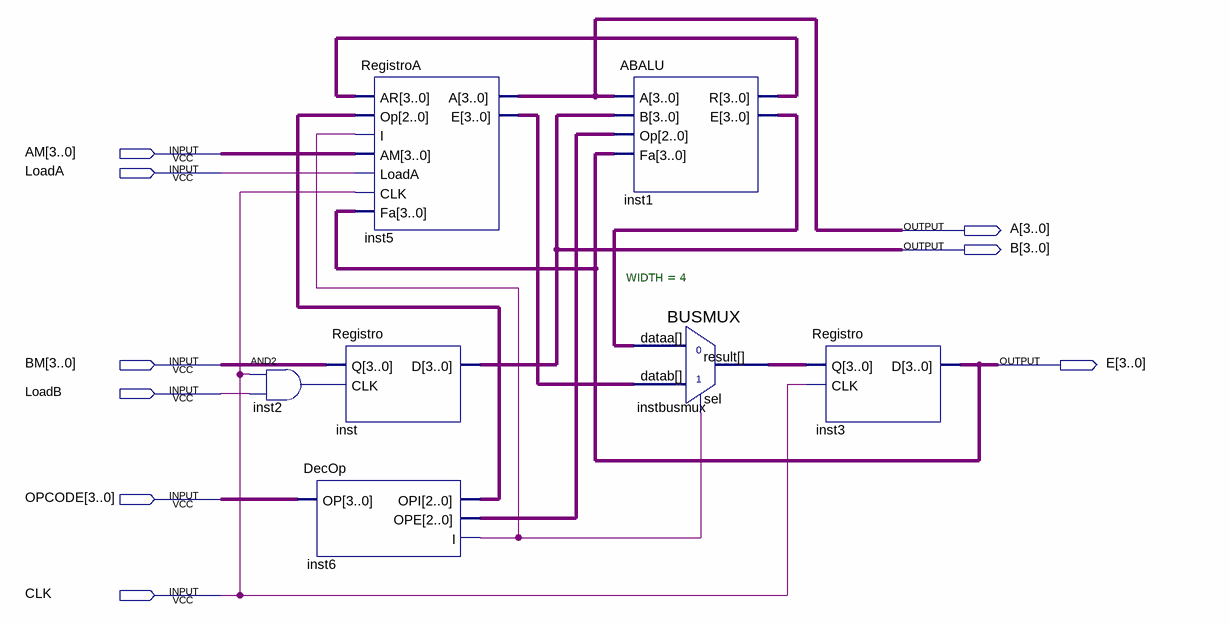
[diagram p0: schematic sheet]
// Quartus schematic ALU.bdf as structural Verilog: 7 symbols, 9 pins
module ALU (
  input  [3:0] AM,
  input  LoadA,
  input  [3:0] BM,
  input  LoadB,
  input  [3:0] OPCODE,
  input  CLK,
  output [3:0] A,
  output [3:0] B,
  output [3:0] E
);

  wire inst2_out, inst6_i;
  wire [2:0] inst6_ope, inst6_opi;
  wire [3:0] inst1_e, inst1_r, inst5_e, instbusmux_result;

  and inst2 (inst2_out, CLK, LoadB);
  DecOp inst6 (.OP(OPCODE), .OPI(inst6_opi), .OPE(inst6_ope), .I(inst6_i));
  RegistroA inst5 (
    .AR(inst1_r), .Op(inst6_opi), .I(inst6_i), .AM(AM), .LoadA(LoadA), .CLK(CLK), .Fa(E), .A(A), .E(inst5_e));
  Registro inst (.Q(BM), .CLK(inst2_out), .D(B));
  ABALU inst1 (.A(A), .B(B), .Op(inst6_ope), .Fa(E), .R(inst1_r), .E(inst1_e));
  BUSMUX #(.WIDTH(4)) instbusmux (.datab(inst5_e), .sel(inst6_i), .dataa(inst1_e), .result(instbusmux_result));
  Registro inst3 (.Q(instbusmux_result), .CLK(CLK), .D(E));
endmodule
